# EAGLE design switchboard1 (EAGLE 7.5.2)
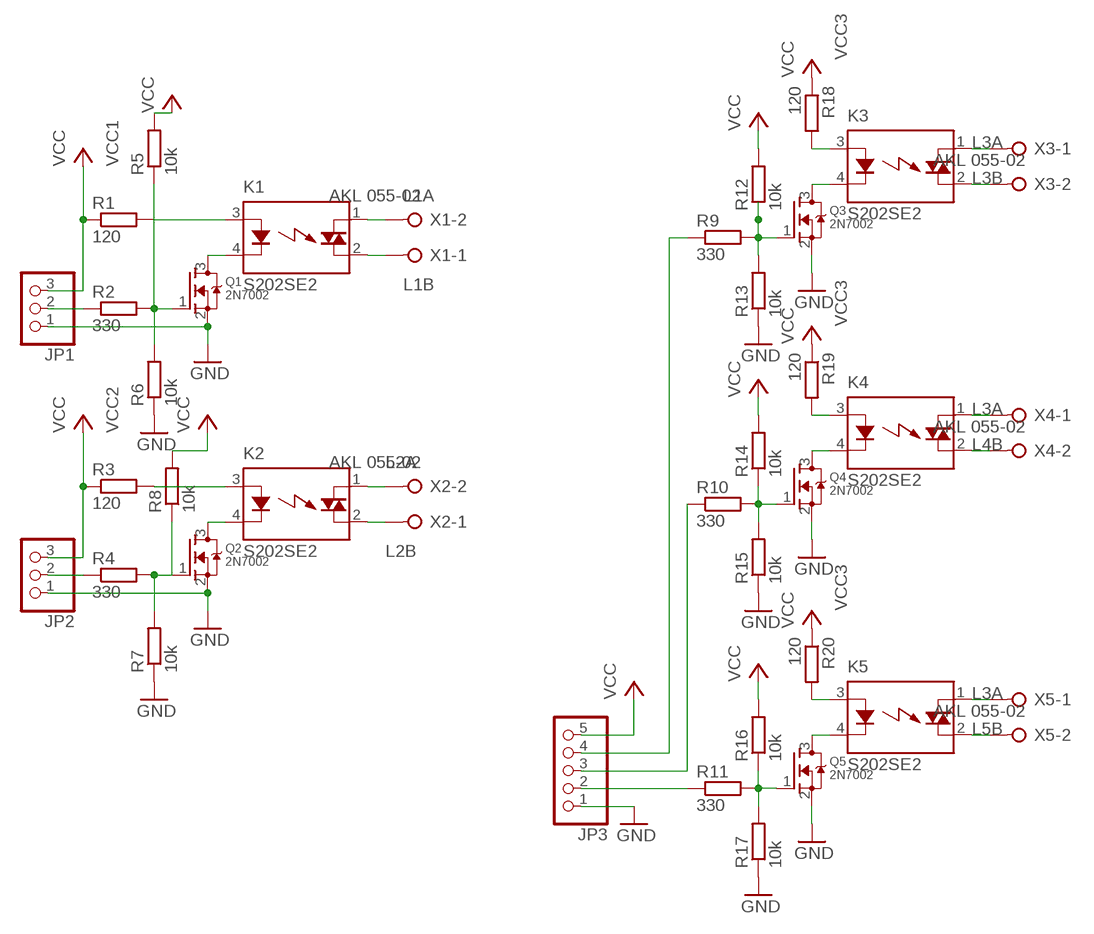
[diagram p0: schematic, sheet 1]

## Parts
JP1  PINHD-1X3  [1X03]
JP2  PINHD-1X3  [1X03]
JP3  PINHD-1X5  [1X05]
K1  S202SE2  [S2XXEX]
K2  S202SE2  [S2XXEX]
K3  S202SE2  [S2XXEX]
K4  S202SE2  [S2XXEX]
K5  S202SE2  [S2XXEX]
Q1  2N7002  MOSFET-NREFLOW  [SOT23]
Q2  2N7002  MOSFET-NREFLOW  [SOT23]
Q3  2N7002  MOSFET-NREFLOW  [SOT23]
Q4  2N7002  MOSFET-NREFLOW  [SOT23]
Q5  2N7002  MOSFET-NREFLOW  [SOT23]
R1  120  R-EU_R0805  [R0805]
R2  330  R-EU_R0805  [R0805]
R3  120  R-EU_R0805  [R0805]
R4  330  R-EU_R0805  [R0805]
R5  10k  R-EU_R0805  [R0805]
R6  10k  R-EU_R0805  [R0805]
R7  10k  R-EU_R0805  [R0805]
R8  10k  R-EU_R0805  [R0805]
R9  330  R-EU_R0805  [R0805]
R10  330  R-EU_R0805  [R0805]
R11  330  R-EU_R0805  [R0805]
R12  10k  R-EU_R0805  [R0805]
R13  10k  R-EU_R0805  [R0805]
R14  10k  R-EU_R0805  [R0805]
R15  10k  R-EU_R0805  [R0805]
R16  10k  R-EU_R0805  [R0805]
R17  10k  R-EU_R0805  [R0805]
R18  120  R-EU_R0805  [R0805]
R19  120  R-EU_R0805  [R0805]
R20  120  R-EU_R0805  [R0805]
X1  AKL 055-02  W237-02P  [W237-132]
X2  AKL 055-02  W237-02P  [W237-132]
X3  AKL 055-02  W237-02P  [W237-132]
X4  AKL 055-02  W237-02P  [W237-132]
X5  AKL 055-02  W237-02P  [W237-132]

## Nets
GND [DCPwr]: JP1.1 JP2.1 JP3.1 Q1.2(S) Q2.2(S) Q3.2(S) Q4.2(S) Q5.2(S) R6.1 R7.1 R13.1 R15.1 R17.1
L1A [ACPwr]: K1.1(DS1) X1.2
L1B [ACPwr]: K1.2(DS2) X1.1
L2A [ACPwr]: K2.1(DS1) X2.2
L2B [ACPwr]: K2.2(DS2) X2.1
L3A [ACPwr]: K3.1(DS1) K4.1(DS1) K5.1(DS1) X3.1 X4.1 X5.1
L3B [ACPwr]: K3.2(DS2) X3.2
L4B [ACPwr]: K4.2(DS2) X4.2
L5B [ACPwr]: K5.2(DS2) X5.2
N$1 [DCPwr]: K1.4(K) Q1.3(D)
N$2 [DCPwr]: K1.3(A) R1.2
N$3: Q1.1(G) R2.2 R5.1 R6.2
N$4: JP1.2 R2.1
N$5 [DCPwr]: K2.3(A) R3.2
N$6 [DCPwr]: K2.4(K) Q2.3(D)
N$7: Q2.1(G) R4.2 R7.2 R8.1
N$8: JP2.2 R4.1
N$9 [DCPwr]: K3.3(A) R18.2
N$10 [DCPwr]: K3.4(K) Q3.3(D)
N$11: Q3.1(G) R9.2 R12.1 R13.2
N$12: JP3.2 R11.1
N$13 [DCPwr]: K4.3(A) R19.2
N$14 [DCPwr]: K4.4(K) Q4.3(D)
N$15: Q4.1(G) R10.2 R14.1 R15.2
N$16: JP3.3 R10.1
N$17 [DCPwr]: K5.3(A) R20.2
N$18 [DCPwr]: K5.4(K) Q5.3(D)
N$19: Q5.1(G) R11.2 R16.1 R17.2
N$20: JP3.4 R9.1
VCC1 [DCPwr]: JP1.3 R1.1 R5.2 ; supply symbol labelled VCC
VCC2 [DCPwr]: JP2.3 R3.1 R8.2 ; supply symbol labelled VCC
VCC3 [DCPwr]: JP3.5 R12.2 R14.2 R16.2 R18.1 R19.1 R20.1 ; supply symbol labelled VCC

## Library data of the parts
JP1 JP2 = adafruit:PINHD-1X3: PIN HEADER
JP3 = pinhead:PINHD-1X5: PIN HEADER
K1-K5 = relay:S2*: SIP Type SSR for Medium Power Control SHARP Source: 168149-da-01-en-Solid_State_Relais_S_202_SE1_SE2.pdf; OC_FARNELL: unknown; OC_NEWARK: unknown
Q1-Q5 = adafruit:MOSFET-N: N-Channel Mosfet 2N7002E - 60V 260mA SOT23 [Digikey: 2N7002ET1GOSTR-ND] - REEL BSH103 - 30V 850mA SOT23 [Digikey: 568-5013-1-ND]
R1-R20 = resistor:R-EU_: RESISTOR, European symbol
X1-X5 = con-wago-508:W237-02P: WAGO SREW CLAMP; OC_FARNELL: unknown; OC_NEWARK: unknown

## Net classes
1 ACPwr: width 0.635 mm, clearance 3 mm
2 DCPwr: width 0.254 mm, clearance 0.254 mm

## Board
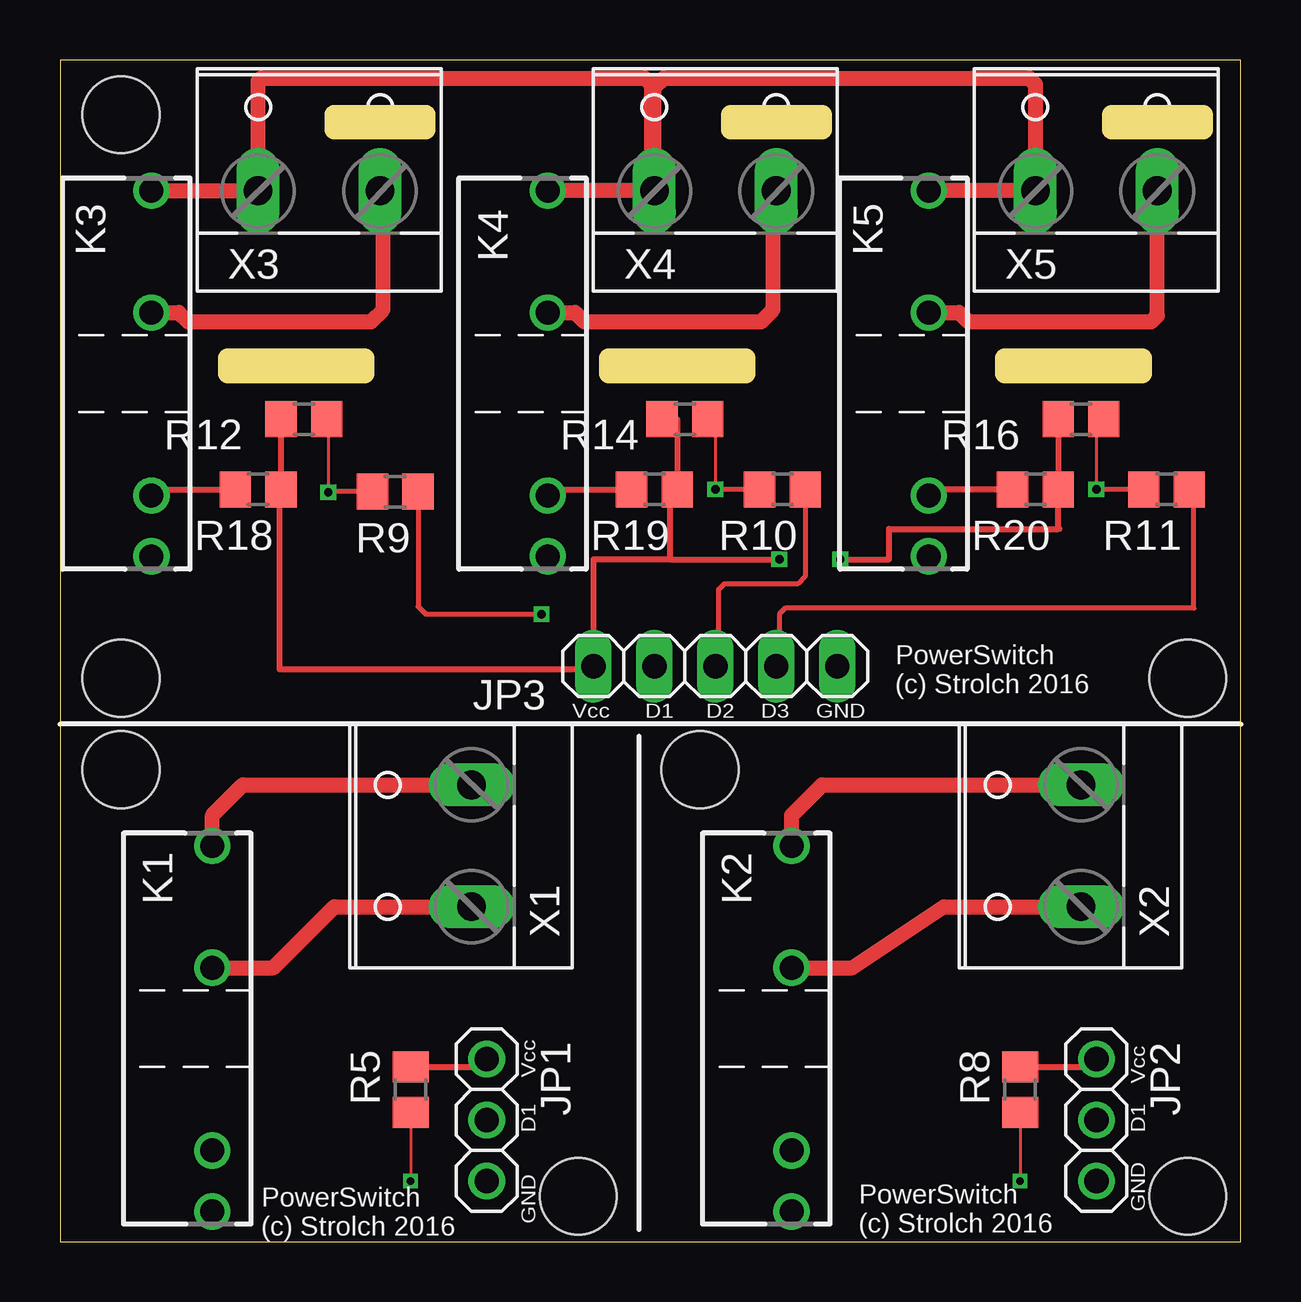
[diagram p1: board, top side]
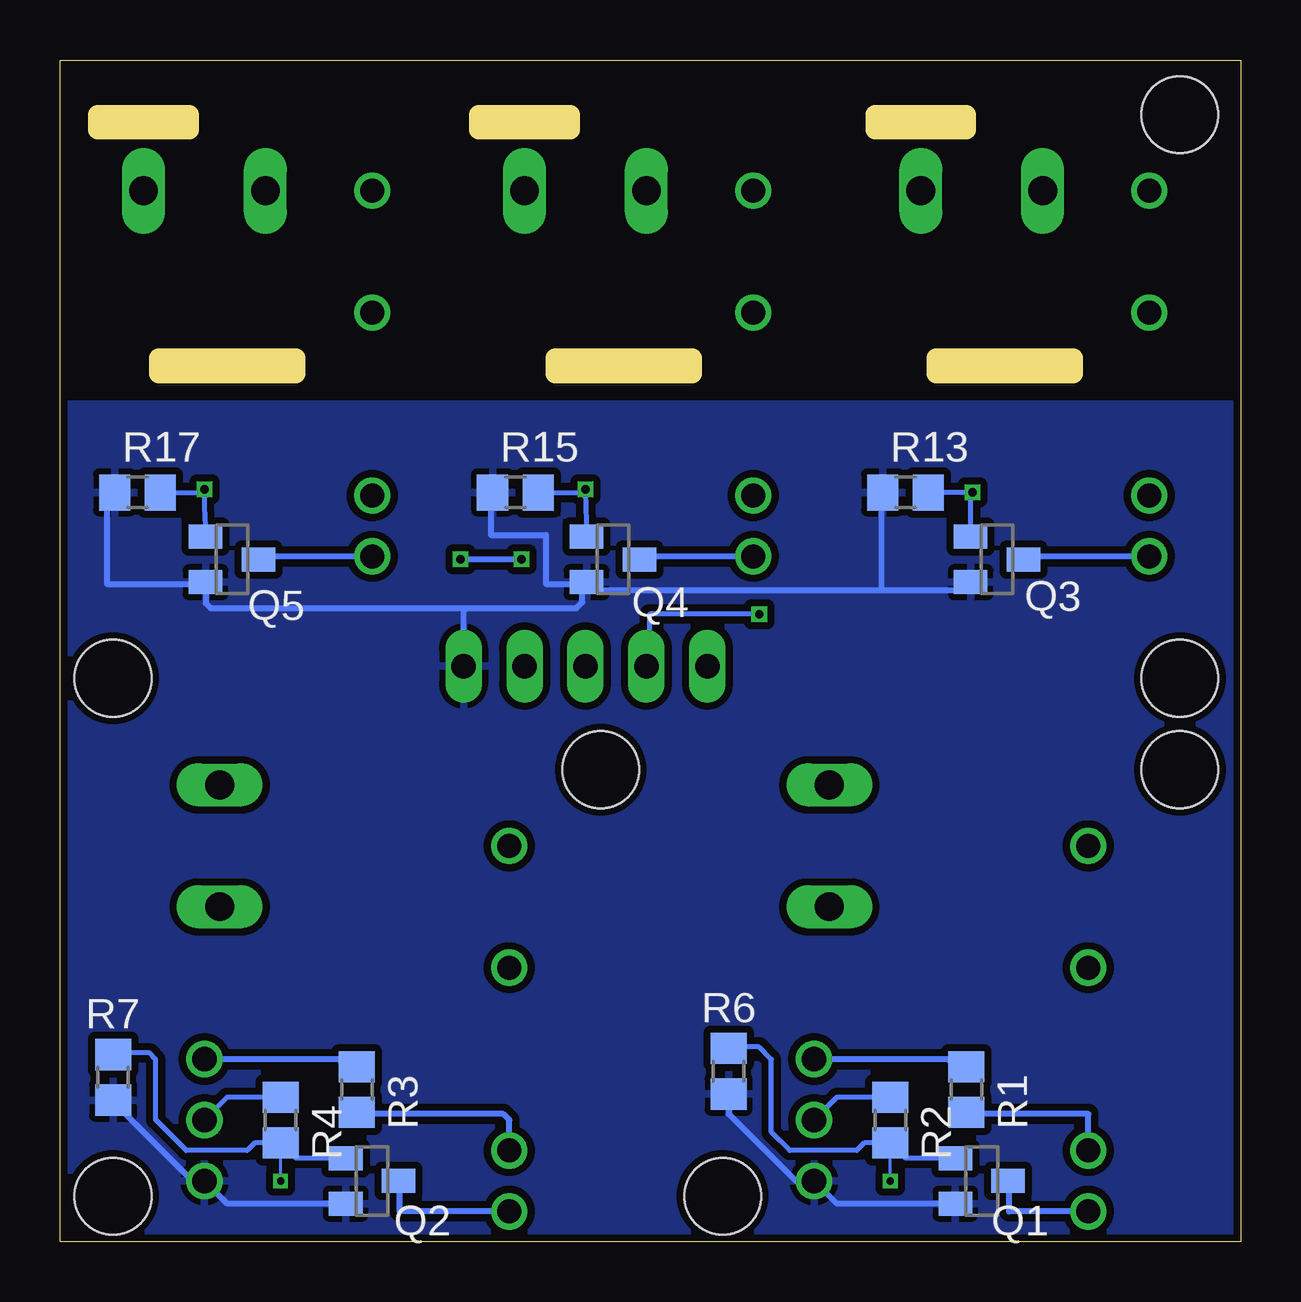
[diagram p2: board, bottom side, seen from below]

Size 49.2 x 49.27 mm. Coordinates in mm from the lower left corner, seen from the top.
Outline: 0,0 49.2,0 49.2,49.27 0,49.27 0,0
Outline: 6.99,36.83 12.7,36.83 12.7,36.2 6.99,36.2 6.99,36.83
Outline: 22.86,36.83 28.57,36.83 28.57,36.2 22.86,36.2 22.86,36.83
Outline: 39.37,36.83 45.09,36.83 45.09,36.2 39.37,36.2 39.37,36.83
Outline: 11.43,46.99 15.24,46.99 15.24,46.35 11.43,46.35 11.43,46.99
Outline: 27.94,46.99 27.94,46.35 31.75,46.35 31.75,46.99 27.94,46.99
Outline: 43.81,46.99 47.62,46.99 47.62,46.35 43.81,46.35 43.81,46.99
Copper layers (1*16): Top 0.035mm / dielectric 1.5mm / Bottom 0.035mm
Design rules "dirt_cheap_dirty_boards.v1": minimum track width 5mil, minimum drill 12mil, track to track 5mil, track to pad 5mil, pad to pad 5mil, via to via 5mil, smd to smd 0mil, copper to edge 10mil, drill to drill 10mil, minimum pad ring 10mil, minimum via ring 6mil, stop-mask expansion 2mil, vias tented up to drill 25mil, thermal gap 10mil
Holes 3.2 mm at 2.54,19.68 26.67,19.68 46.99,1.91 21.59,1.91 2.54,23.5 2.54,46.99 46.99,23.5

### Footprints (pad centres in the part's own frame; a part is rotated, then mirrored left to right if it is on the bottom)
1X03 = drill 1.016: 1 -2.54,0; 2 0,0; 3 2.54,0
1X05 = drill 1.016 long: 1 -5.08,0; 2 -2.54,0; 3 0,0; 4 2.54,0; 5 5.08,0
S2XXEX = drill 1: 1 -7.62,0; 2 -2.54,0; 3 5.08,0; 4 7.62,0
SOT23 = smd 1 x 1.4: 1 -0.95,-1.1; 2 0.95,-1.1; 3 0,1.1
R0805 = smd 1.3 x 1.5: 1 -0.95,0; 2 0.95,0
W237-132 = drill 1.194 long: 1 -2.54,-0.635; 2 2.54,-0.635

### Placement (x,y rotation side)
JP1  17.78,5.08 90 top
JP2  43.18,5.08 90 top
JP3  27.3,24 180 top
K1  6.35,8.89 270 top
K2  30.48,8.89 270 top
K3  3.81,36.2 270 top
K4  20.32,36.2 270 top
K5  36.2,36.2 270 top
Q1  10.79,2.54 270 bottom
Q2  36.2,2.54 270 bottom
Q3  10.16,28.45 270 bottom
Q4  26.16,28.45 270 bottom
Q5  42.04,28.45 270 bottom
R1  11.43,6.35 270 bottom
R2  14.61,5.08 270 bottom
R3  36.83,6.35 270 bottom
R4  40.01,5.08 270 bottom
R5  14.61,6.35 90 top
R6  21.34,7.11 90 bottom
R7  46.99,6.86 90 bottom
R8  40.01,6.35 90 top
R9  13.97,31.27 180 top
R10  30.1,31.37 180 top
R11  46.1,31.37 180 top
R12  10.16,34.29 180 top
R13  13.97,31.24 0 bottom
R14  26.04,34.29 180 top
R15  30.23,31.24 0 bottom
R16  42.55,34.29 180 top
R17  45.97,31.24 0 bottom
R18  8.26,31.37 180 top
R19  24.77,31.37 180 top
R20  40.64,31.37 180 top
X1  16.51,16.51 90 top
X2  41.91,16.51 90 top
X3  10.79,44.45 0 top
X4  27.3,44.45 0 top
X5  43.18,44.45 0 top

### Tracks (layer width: path | path; a pad name or v marks a point on that pad's centre or on a via)
GND
  Bottom 0.254: Q1.2 16.83,1.59 JP1.1 18.54,2.54 21.34,5.33 R6.1 | Q2.2 42.23,1.59 JP2.1 43.69,2.54 46.99,5.84 R7.1 | 32.26,26.42 42.93,26.42 43.14,26.63 Q5.2 43.14,27.43 47.24,27.43 47.24,31.24 R17.1 | 32.26,26.42 27.69,26.42 27.43,26.67 27.43,27.33 Q4.2 | JP3.1 32.38,26.29 32.26,26.42 | Q4.2 26.99,27.5 26.67,27.18 14.99,27.18 | 14.99,27.18 11.58,27.18 Q3.2 | R13.1 14.99,31.24 14.99,27.18 | R15.1 31.24,31.24 31.24,29.46 28.96,29.46 28.96,27.43 27.26,27.43 Q4.2
  pour Bottom (isolate 0.305): 0,34.92 48.9,34.92 48.9,0 0,0
L1A
  Top 0.635: K1.1 6.35,17.78 7.62,19.05 X1.2 17.74,19.05
L1B
  Top 0.635: K1.2 8.89,11.43 11.43,13.97 X1.1 17.74,13.97
L2A
  Top 0.635: K2.1 30.48,17.78 31.75,19.05 X2.2 43.14,19.05
L2B
  Top 0.635: K2.2 33.02,11.43 36.83,13.97 X2.1 43.14,13.97
L3A
  Top 0.635: K3.1 X3.1 8.26,48.39 8.38,48.51 24.38,48.51 24.64,48.26 24.64,43.94 X4.1 | K5.1 X5.1 40.64,48.26 40.39,48.51 25.15,48.51 24.77,48.13 X4.1 | X4.1 K4.1
L3B
  Top 0.635: K3.2 4.95,38.73 5.33,38.35 12.95,38.35 13.46,38.86 13.46,43.69 X3.2
L4B
  Top 0.635: K4.2 21.46,38.73 21.84,38.35 29.21,38.35 29.72,38.86 29.72,43.69 X4.2
L5B
  Top 0.635: K5.2 37.47,38.73 37.85,38.35 45.47,38.35 45.72,38.61 X5.2
N$1
  Bottom 0.254: K1.4 9.65,1.27 9.65,2.5 Q1.3
N$2
  Bottom 0.254: K1.3 6.35,5.33 11.36,5.33 R1.2
N$3  (via drill 0.3)
  Top 0.127: R5.1 v14.61,2.54
  Bottom 0.127: v14.61,2.54 R2.2
  Bottom 0.2: Q1.1 13.96,3.49 R2.2 15.68,4.13 16,3.81 18.8,3.81 19.56,4.57 19.56,7.62 20.07,8.13 21.27,8.13 R6.2
N$4
  Bottom 0.2: R2.1 16.83,6.03 JP1.2
N$5
  Bottom 0.254: K2.3 30.48,5.08 30.73,5.33 36.76,5.33 R3.2
N$6
  Bottom 0.254: K2.4 35.05,1.27 35.05,2.5 Q2.3
N$7  (via drill 0.3)
  Top 0.127: R8.1 v40.01,2.54
  Bottom 0.127: v40.01,2.54 R4.2
  Bottom 0.2: Q2.1 39.37,3.49 R4.2 41.08,4.13 41.4,3.81 43.94,3.81 45.21,5.08 45.21,7.62 45.47,7.87 46.92,7.87 R7.2
N$8
  Bottom 0.2: R4.1 42.23,6.03 JP2.2
N$9
  Top 0.254: 3.81,30.99 K3.3 4.06,31.37 R18.2
N$10
  Bottom 0.254: K3.4 9.06,28.57 Q3.3
N$11  (via drill 0.35)
  Top 0.127: R12.1 11.18,34.29 v11.18,31.24
  Top 0.2: R9.2 11.2,31.27 v11.18,31.24
  Bottom 0.2: Q3.1 11.26,31.16 v11.18,31.24 R13.2
N$12
  Top 0.2: JP3.2 29.97,24.89 29.97,26.16 30.23,26.42 47.24,26.42 47.24,31.05 R11.1
N$13
  Top 0.254: K4.3 20.57,31.37 R19.2
N$14
  Bottom 0.254: K4.4 25.57,28.57 Q4.3
N$15  (via drill 0.35)
  Top 0.127: R14.1 27.3,34.29 v27.3,31.37
  Top 0.2: R10.2 v27.3,31.37
  Bottom 0.2: Q4.1 27.3,31.26 v27.3,31.37 27.3,31.24 R15.2
N$16
  Top 0.2: R10.1 31.05,27.75 30.73,27.43 27.69,27.43 27.43,27.18 27.43,24.13 JP3.3
N$17
  Top 0.254: R20.2 36.45,31.37 K5.3
N$18
  Bottom 0.254: K5.4 40.81,28.57 Q5.3
N$19  (via drill 0.35)
  Top 0.127: R16.1 43.18,34.29 v43.18,31.37
  Top 0.2: R11.2 v43.18,31.37
  Bottom 0.2: Q5.1 43.18,30.62 v43.18,31.37 43.18,31.24 R17.2
N$20  (via drill 0.35)
  Top 0.2: R9.1 14.92,26.48 15.24,26.16 v20.07,26.16
  Bottom 0.2: v20.07,26.16 24.64,26.16 24.64,24.89 JP3.4
VCC1
  Top 0.254: R5.2 17.78,7.3 JP1.3
  Bottom 0.254: R1.1 11.87,7.3 12.19,7.62 JP1.3
VCC2
  Top 0.254: R8.2 43.18,7.3 JP2.3
  Bottom 0.254: R3.1 37.27,7.3 37.59,7.62 JP2.3
VCC3  (via drill 0.35)
  Top 0.254: 25.4,28.45 22.23,28.45 JP3.5 22.23,23.88 9.14,23.88 9.14,31.37 R18.1 R12.2 | 25.4,28.45 25.4,31.37 R19.1 25.71,34.29 R14.2 | 25.4,28.45 v29.97,28.45 | v32.51,28.45 34.54,28.45 34.54,29.72 41.59,29.72 | 41.66,29.72 41.59,29.72 | 41.59,29.72 R20.1 R16.2
  Bottom 0.254: v29.97,28.45 v32.51,28.45

### Text on the board
tNames: PowerSwitch / (c) Strolch 2016 | Vcc | D1 | D2 | D3 | GND | Vcc | Vcc | D1 | D1 | GND | GND | PowerSwitch / (c) Strolch 2016 | PowerSwitch / (c) Strolch 2016